# Altium schematic sheet audio.SchDoc: Audio speaker amplifier
size A4; Organization: Institut d'Automatisation Industrielle; SVN: OUI; ProjectName: <projet>
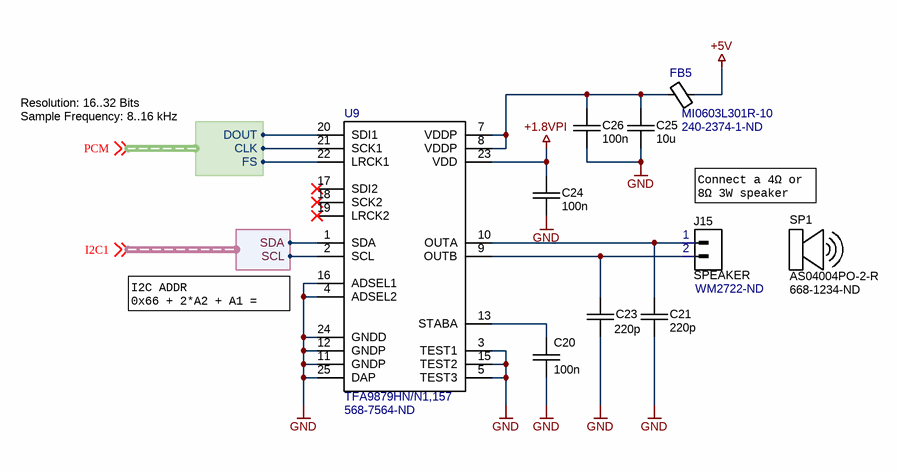
[diagram p0: audio.SchDoc]

## Parts
C20  100n  [SM/C0603]
C21  220p  [SM/C0603]
C23  220p  [SM/C0603]
C24  100n  [SM/C0603]
C25  10u  [SM/C0805]
C26  100n  [SM/C0603]
FB5  MI0603L301R-10  Supplier Part Number 1: 240-2374-1-ND  [SM/L0603]
J15  SPEAKER  Supplier Part Number 1: WM2722-ND  [CONN/HEADER/2.54mm/2POS]
SP1  AS04004PO-2-R  Supplier Part Number 1: 668-1234-ND  (mechanical)
U9  TFA9879HN/N1,157  Supplier Part Number 1: 568-7564-ND  [QFN50P260X260X100-25N]

## Harnesses
I2C: SDA, SCL
PCM: CLK, FS, DOUT

## Nets
+1.8VPI: C24.1 U9.23(VDD)
+5V: FB5.1
GND: C20.2 C21.2 C23.2 C24.2 C25.2 C26.2 U9.3(TEST1) U9.4(ADSEL2) U9.5(TEST3) U9.11(GNDP) U9.12(GNDP) U9.15(TEST2) U9.16(ADSEL1) U9.24(GNDD) U9.25(DAP)
NetC20_1: C20.1 U9.13(STABA)
NetC21_1: C21.1 J15.1 U9.10(OUTA)
NetC23_1: C23.1 J15.2 U9.9(OUTB)
NetC25_1: C25.1 C26.1 FB5.2 U9.7(VDDP) U9.8(VDDP)
NetU9_1: U9.1(SDA) ; harness I2C.SDA
NetU9_2: U9.2(SCL) ; harness I2C.SCL
NetU9_20: U9.20(SDI1) ; harness PCM.DOUT
NetU9_21: U9.21(SCK1) ; harness PCM.CLK
NetU9_22: U9.22(LRCK1) ; harness PCM.FS

Not connected (* = marked no-connect by the designer): U9 17(SDI2)* 18(SCK2)* 19(LRCK2)*

## Notes on the sheet
- Resolution: 16..32 Bits
  Sample Frequency: 8..16 kHz
- Connect a 4Ω or 8Ω 3W speaker
- I2C ADDR
  0x66 + 2*A2 + A1 = 0x6c
- Labels drawn without touching a wire or pin: I2C1, PCM
- HES-SO / HEIG-VD / TIN / IAI
  Route de Cheseaux, 1
  CH-1401 Yverdon-les-Bains
  +41 24 557 73 77
  http://iai.heig-vd.ch
  iai@heig-vd.ch
- Title
- Format
- Date
- A4
- Project Name
- Author
- Project ID
- VCS
- Revision
- Page
- /
- File

## Library data of the parts
C20 C21 C23 C24 C26 = C: Chip Capacitor; Voltage: 16V; Dielectric: X7R
  C20 C24 C26: Supplier 2 Part Number: 1292-1393-1-ND; Supplier 2: Digi-Key
C25 = C: CAP CER 10UF 10V X5R 0805; Supplier 1: Digi-Key; Supplier Part Number 1: 1276-2402-1-ND
FB5 = FB0603: Supplier 1: Digi-Key
J15 = CONN 2 MALE: Supplier 1: Digi-Key
SP1 = SPEAKER/3W: SPEAKER 4OHM 3W TOP PORT 82DB; Supplier 1: Digi-Key
U9 = TFA9879: IC AMP CLSS D MONO 2.75W 24HVQFN; Supplier 1: Digi-Key